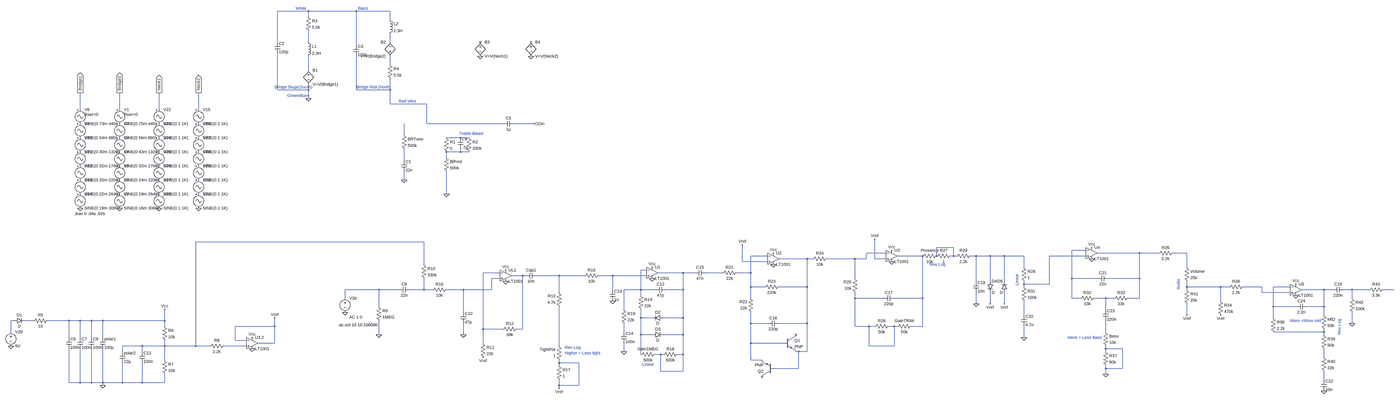
[diagram p0: schematic SST1Circuit.asc, whole sheet]
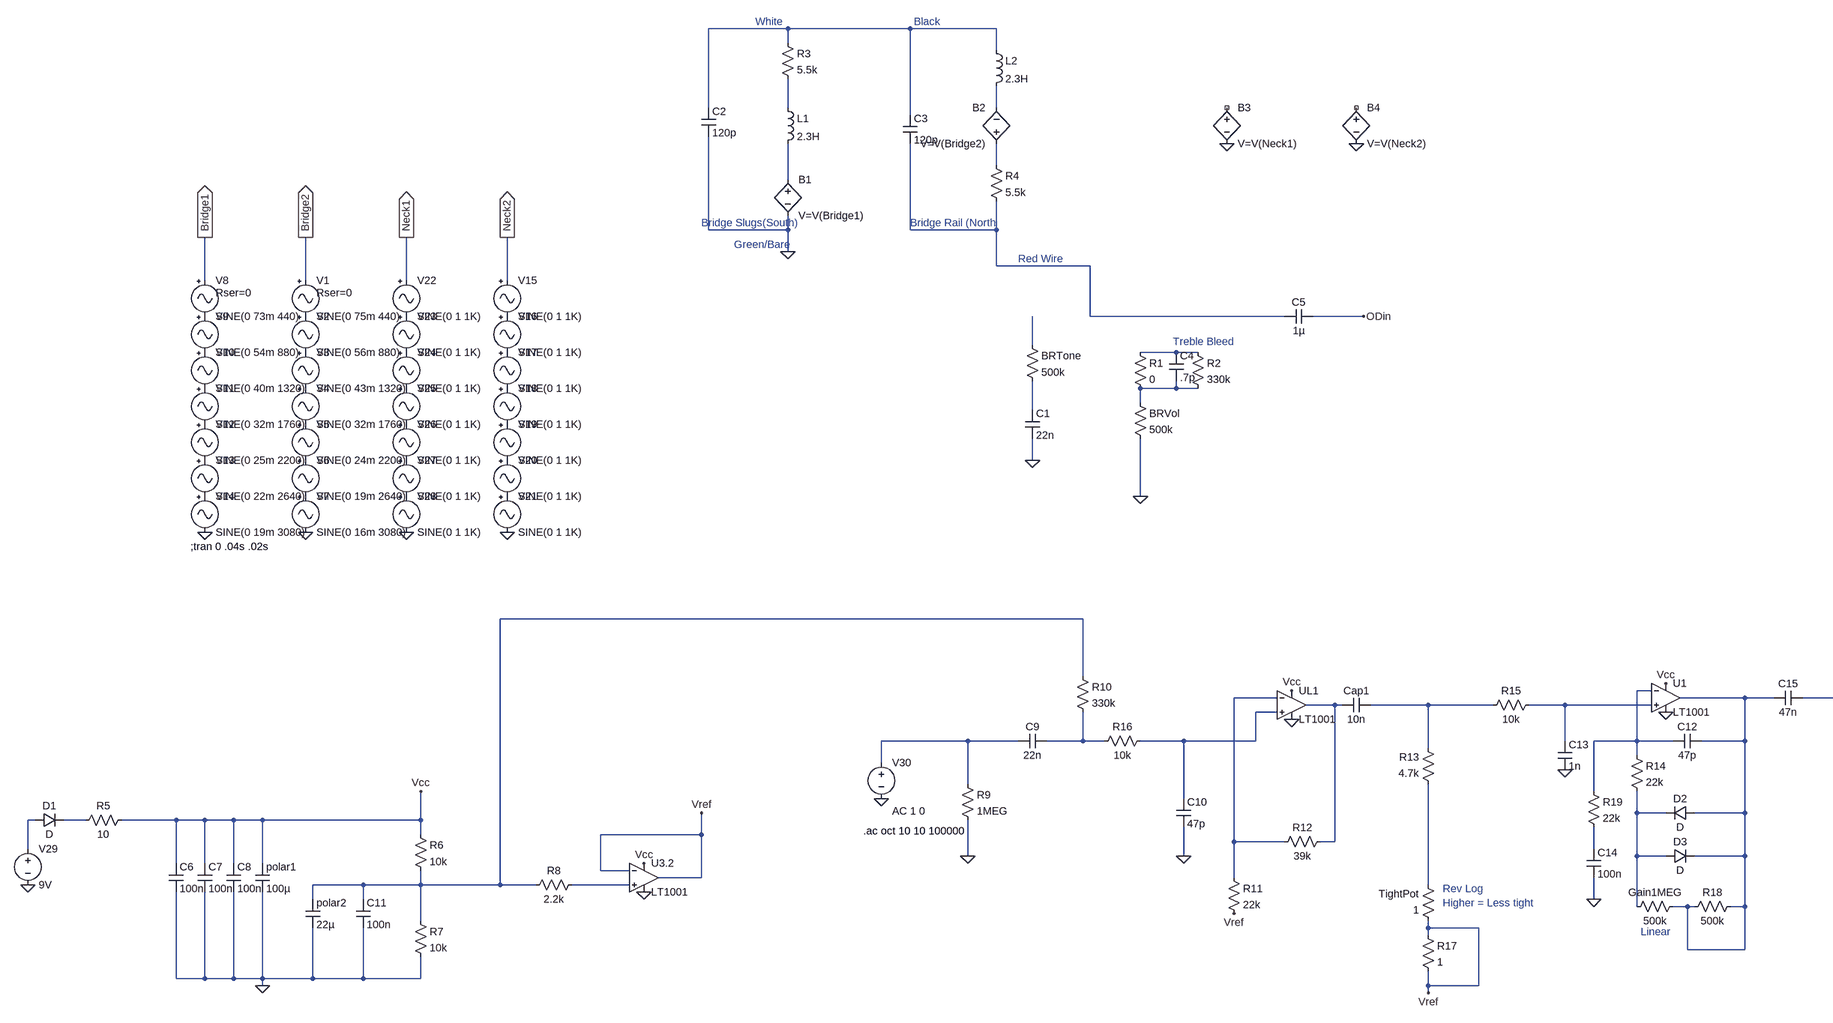
[diagram p1: schematic SST1Circuit.asc, part, row 1 of 1, column 1 of 2]
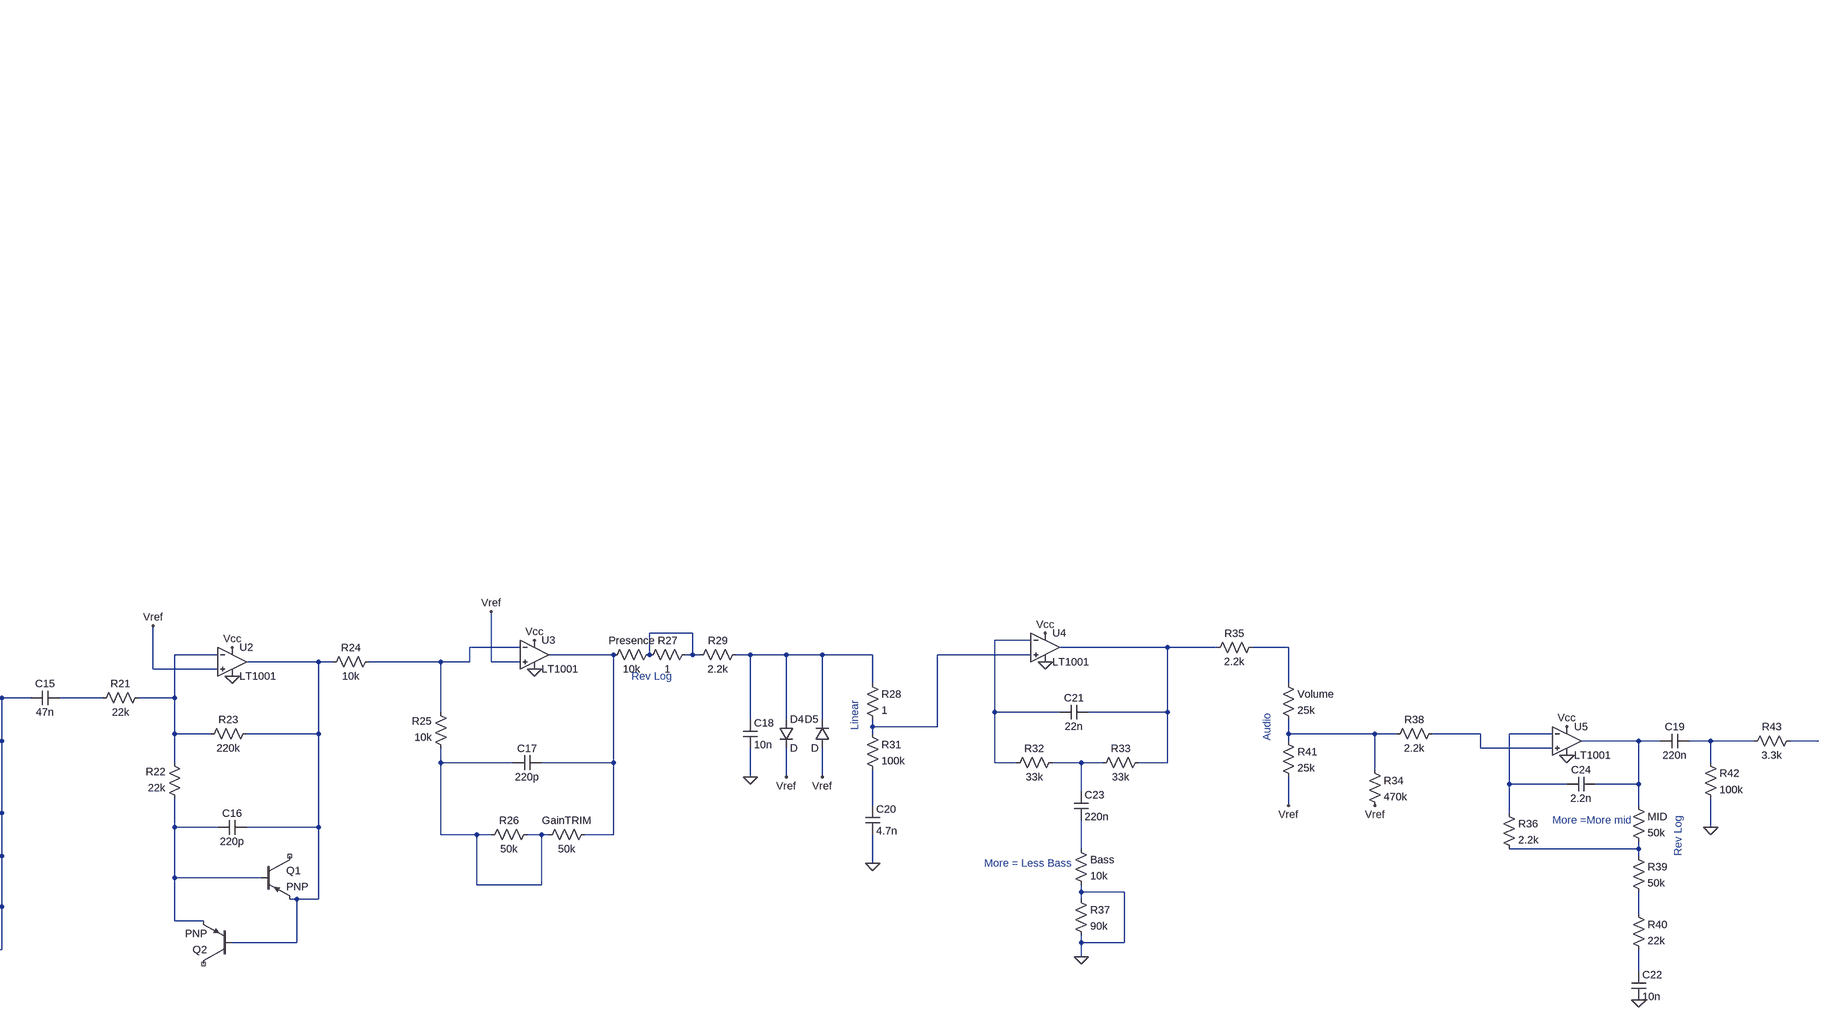
[diagram p2: schematic SST1Circuit.asc, part, row 1 of 1, column 2 of 2]
SST1Circuit.asc, the LTspice schematic file:
Version 4
SHEET 1 7556 1668
WIRE 944 -848 768 -848
WIRE 1216 -848 944 -848
WIRE 1408 -848 1216 -848
WIRE 944 -816 944 -848
WIRE 1408 -800 1408 -848
WIRE 768 -672 768 -848
WIRE 944 -672 944 -736
WIRE 1408 -672 1408 -720
WIRE 1216 -656 1216 -848
WIRE 1408 -544 1408 -592
WIRE 944 -512 944 -592
WIRE 768 -400 768 -608
WIRE 944 -400 944 -432
WIRE 944 -400 768 -400
WIRE 1216 -400 1216 -592
WIRE 1408 -400 1408 -464
WIRE 1408 -400 1216 -400
WIRE 944 -352 944 -400
WIRE 1408 -320 1408 -400
WIRE 1616 -320 1408 -320
WIRE -352 -288 -352 -384
WIRE -128 -288 -128 -384
WIRE 96 -288 96 -384
WIRE 320 -288 320 -384
WIRE 1616 -208 1616 -320
WIRE 2048 -208 1616 -208
WIRE 2224 -208 2112 -208
WIRE 1488 -144 1488 -208
WIRE 1808 -128 1728 -128
WIRE 1856 -128 1808 -128
WIRE 1808 -48 1808 -64
WIRE 1808 -48 1728 -48
WIRE 1856 -48 1808 -48
WIRE 1728 -16 1728 -48
WIRE 1488 0 1488 -64
WIRE 1488 112 1488 64
WIRE 1728 192 1728 64
WIRE 1600 656 304 656
WIRE 4608 688 4512 688
WIRE 5408 704 5328 704
WIRE 4224 720 4112 720
WIRE 5712 720 5472 720
WIRE 5856 720 5712 720
WIRE 6016 720 5936 720
WIRE 3552 736 3456 736
WIRE 4432 736 4288 736
WIRE 4512 736 4512 688
WIRE 4608 736 4608 688
WIRE 4608 736 4592 736
WIRE 4624 736 4608 736
WIRE 4736 736 4704 736
WIRE 4816 736 4736 736
WIRE 4896 736 4816 736
WIRE 5008 736 4896 736
WIRE 5408 736 5152 736
WIRE 3776 752 3616 752
WIRE 3808 752 3776 752
WIRE 4048 752 3888 752
WIRE 4112 752 4112 720
WIRE 4112 752 4048 752
WIRE 4160 752 4160 640
WIRE 4224 752 4160 752
WIRE 3408 768 3408 672
WIRE 3552 768 3408 768
WIRE 1600 784 1600 656
WIRE 5008 800 5008 736
WIRE 6016 800 6016 720
WIRE 2864 816 2832 816
WIRE 2032 832 1936 832
WIRE 3072 832 2928 832
WIRE 3136 832 3072 832
WIRE 3296 832 3200 832
WIRE 3456 832 3456 736
WIRE 3456 832 3376 832
WIRE 2160 848 2096 848
WIRE 2176 848 2160 848
WIRE 2368 848 2240 848
WIRE 2512 848 2368 848
WIRE 2672 848 2592 848
WIRE 2864 848 2672 848
WIRE 2032 864 1984 864
WIRE 4048 864 4048 752
WIRE 5328 864 5328 704
WIRE 5472 864 5328 864
WIRE 5712 864 5712 720
WIRE 5712 864 5536 864
WIRE 4736 880 4736 736
WIRE 4816 880 4816 736
WIRE 4896 880 4896 736
WIRE 5008 896 5008 880
WIRE 5152 896 5152 736
WIRE 5152 896 5008 896
WIRE 3456 912 3456 832
WIRE 3536 912 3456 912
WIRE 3776 912 3776 752
WIRE 3776 912 3616 912
WIRE 5008 912 5008 896
WIRE 6016 912 6016 880
WIRE 6208 912 6016 912
WIRE 6256 912 6208 912
WIRE 6496 912 6336 912
WIRE 6656 912 6560 912
WIRE 1344 928 1152 928
WIRE 1456 928 1344 928
WIRE 1600 928 1600 864
WIRE 1600 928 1520 928
WIRE 1648 928 1600 928
WIRE 1824 928 1728 928
WIRE 1984 928 1984 864
WIRE 1984 928 1824 928
WIRE 2672 928 2672 848
WIRE 2832 928 2832 816
WIRE 2832 928 2736 928
WIRE 2912 928 2832 928
WIRE 3072 928 3072 832
WIRE 3072 928 2976 928
WIRE 6016 928 6016 912
WIRE 6848 928 6720 928
WIRE 6896 928 6848 928
WIRE 7008 928 6960 928
WIRE 7104 928 7008 928
WIRE 7248 928 7184 928
WIRE 2368 944 2368 848
WIRE 6496 944 6496 912
WIRE 6656 944 6496 944
WIRE 2832 960 2832 928
WIRE 1152 976 1152 928
WIRE 3456 976 3456 912
WIRE 4048 976 4048 944
WIRE 4208 976 4048 976
WIRE 4432 976 4432 736
WIRE 4432 976 4272 976
WIRE 5328 976 5328 864
WIRE 5376 976 5328 976
WIRE 5520 976 5456 976
WIRE 5568 976 5520 976
WIRE 5712 976 5712 864
WIRE 5712 976 5648 976
WIRE 7008 976 7008 928
WIRE 6208 992 6208 912
WIRE 4736 1008 4736 944
WIRE 4816 1008 4816 944
WIRE 4896 1008 4896 944
WIRE 1344 1024 1344 928
WIRE 6560 1024 6560 912
WIRE 6688 1024 6560 1024
WIRE 6848 1024 6848 928
WIRE 6848 1024 6752 1024
WIRE 2736 1040 2736 928
WIRE 5520 1040 5520 976
WIRE 1824 1056 1824 928
WIRE 5008 1072 5008 992
WIRE 6016 1072 6016 1008
WIRE 6848 1072 6848 1024
WIRE 2832 1088 2832 1040
WIRE 2896 1088 2832 1088
WIRE 3072 1088 3072 928
WIRE 3072 1088 2960 1088
WIRE 6560 1088 6560 1024
WIRE -768 1104 -784 1104
WIRE -656 1104 -704 1104
WIRE -416 1104 -576 1104
WIRE -352 1104 -416 1104
WIRE -288 1104 -352 1104
WIRE -224 1104 -288 1104
WIRE 128 1104 128 1040
WIRE 128 1104 -224 1104
WIRE 3456 1120 3456 1056
WIRE 3552 1120 3456 1120
WIRE 3776 1120 3776 912
WIRE 3776 1120 3616 1120
WIRE 7008 1120 7008 1056
WIRE 128 1136 128 1104
WIRE 752 1136 752 1088
WIRE 752 1136 528 1136
WIRE 4048 1136 4048 976
WIRE 4128 1136 4048 1136
WIRE 4160 1136 4128 1136
WIRE 4272 1136 4240 1136
WIRE 4288 1136 4272 1136
WIRE 4432 1136 4432 976
WIRE 4432 1136 4368 1136
WIRE 1936 1152 1936 832
WIRE 2048 1152 1936 1152
WIRE 2160 1152 2160 848
WIRE 2160 1152 2128 1152
WIRE -784 1168 -784 1104
WIRE 2736 1168 2736 1120
WIRE 5520 1168 5520 1104
WIRE 6848 1168 6848 1152
WIRE 6848 1168 6560 1168
WIRE 1344 1184 1344 1104
WIRE 1824 1184 1824 1120
WIRE 2832 1184 2832 1088
WIRE 2896 1184 2832 1184
WIRE 3072 1184 3072 1088
WIRE 3072 1184 2960 1184
WIRE 6848 1184 6848 1168
WIRE -416 1200 -416 1104
WIRE -352 1200 -352 1104
WIRE -288 1200 -288 1104
WIRE -224 1200 -224 1104
WIRE 5008 1200 5008 1136
WIRE 528 1216 528 1136
WIRE 592 1216 528 1216
WIRE 752 1232 752 1136
WIRE 752 1232 656 1232
WIRE 1936 1232 1936 1152
WIRE 3456 1232 3456 1120
WIRE 3648 1232 3456 1232
WIRE 0 1248 -112 1248
WIRE 128 1248 128 1216
WIRE 128 1248 0 1248
WIRE 304 1248 304 656
WIRE 304 1248 128 1248
WIRE 384 1248 304 1248
WIRE 592 1248 464 1248
WIRE 2368 1248 2368 1024
WIRE 4128 1248 4128 1136
WIRE 4272 1248 4272 1136
WIRE 4272 1248 4128 1248
WIRE 5520 1264 5520 1248
WIRE 5616 1264 5520 1264
WIRE -112 1280 -112 1248
WIRE 0 1280 0 1248
WIRE 2736 1280 2736 1232
WIRE 3728 1280 3712 1280
WIRE 3776 1280 3776 1120
WIRE 3776 1280 3728 1280
WIRE 5520 1280 5520 1264
WIRE 2832 1296 2832 1184
WIRE 2944 1296 2912 1296
WIRE 2960 1296 2944 1296
WIRE 3072 1296 3072 1184
WIRE 3072 1296 3040 1296
WIRE 6848 1312 6848 1264
WIRE 128 1328 128 1248
WIRE 3456 1328 3456 1232
WIRE 3520 1328 3456 1328
WIRE 2368 1344 2368 1328
WIRE 2480 1344 2368 1344
WIRE 2368 1360 2368 1344
WIRE 3728 1376 3728 1280
WIRE 3728 1376 3584 1376
WIRE 5520 1376 5520 1360
WIRE 5616 1376 5616 1264
WIRE 5616 1376 5520 1376
WIRE 2944 1392 2944 1296
WIRE 3072 1392 3072 1296
WIRE 3072 1392 2944 1392
WIRE 5520 1408 5520 1376
WIRE 6848 1440 6848 1392
WIRE -416 1456 -416 1264
WIRE -352 1456 -352 1264
WIRE -352 1456 -416 1456
WIRE -288 1456 -288 1264
WIRE -288 1456 -352 1456
WIRE -224 1456 -224 1264
WIRE -224 1456 -288 1456
WIRE -112 1456 -112 1344
WIRE -112 1456 -224 1456
WIRE 0 1456 0 1344
WIRE 0 1456 -112 1456
WIRE 128 1456 128 1408
WIRE 128 1456 0 1456
WIRE -224 1472 -224 1456
WIRE 2368 1472 2368 1440
WIRE 2480 1472 2480 1344
WIRE 2480 1472 2368 1472
WIRE 2368 1488 2368 1472
FLAG -352 272 0
FLAG -128 272 0
FLAG 96 272 0
FLAG 320 272 0
FLAG -352 -384 Bridge1
IOPIN -352 -384 Out
FLAG -128 -384 Bridge2
IOPIN -128 -384 Out
FLAG 96 -384 Neck1
IOPIN 96 -384 Out
FLAG 320 -384 Neck2
IOPIN 320 -384 Out
FLAG 1920 -592 0
FLAG 2208 -592 0
FLAG 944 -352 0
FLAG 1488 112 0
FLAG 1728 192 0
FLAG 2224 -208 ODin
FLAG -784 1248 0
FLAG 624 1264 0
FLAG -224 1472 0
FLAG 752 1088 Vref
FLAG 128 1040 Vcc
FLAG 624 1200 Vcc
FLAG 1936 1312 Vref
FLAG 1824 1184 0
FLAG 1344 1184 0
FLAG 2064 880 0
FLAG 2064 816 Vcc
FLAG 2672 992 0
FLAG 2896 864 0
FLAG 2896 800 Vcc
FLAG 2368 1488 Vref
FLAG 3584 784 0
FLAG 3584 720 Vcc
FLAG 3408 672 Vref
FLAG 4160 640 Vref
FLAG 4256 768 0
FLAG 4256 704 Vcc
FLAG 5008 1200 0
FLAG 5440 688 Vcc
FLAG 5440 752 0
FLAG 1152 1056 0
FLAG 6688 896 Vcc
FLAG 6688 960 0
FLAG 6848 1504 0
FLAG 5520 1408 0
FLAG 2736 1280 0
FLAG 4736 1008 0
FLAG 4816 1008 Vref
FLAG 4896 1008 Vref
FLAG 6016 1072 Vref
FLAG 6208 1072 Vref
FLAG 7008 1120 0
SYMBOL Misc\\signal -128 -304 R0
WINDOW 123 0 0 Left 2
WINDOW 39 24 44 Left 2
SYMATTR SpiceLine Rser=0
SYMATTR InstName V1
SYMATTR Value SINE(0 75m 440)
SYMBOL Misc\\signal -128 -224 R0
WINDOW 123 0 0 Left 2
WINDOW 39 0 0 Left 2
SYMATTR InstName V2
SYMATTR Value SINE(0 56m 880)
SYMBOL Misc\\signal -128 -144 R0
WINDOW 123 0 0 Left 2
WINDOW 39 0 0 Left 2
SYMATTR InstName V3
SYMATTR Value SINE(0 43m 1320)
SYMBOL Misc\\signal -128 -64 R0
WINDOW 123 0 0 Left 2
WINDOW 39 0 0 Left 2
SYMATTR InstName V4
SYMATTR Value SINE(0 32m 1760)
SYMBOL Misc\\signal -128 16 R0
WINDOW 123 0 0 Left 2
WINDOW 39 0 0 Left 2
SYMATTR InstName V5
SYMATTR Value SINE(0 24m 2200)
SYMBOL Misc\\signal -128 96 R0
WINDOW 123 0 0 Left 2
WINDOW 39 0 0 Left 2
SYMATTR InstName V6
SYMATTR Value SINE(0 19m 2640)
SYMBOL Misc\\signal -128 176 R0
WINDOW 123 0 0 Left 2
WINDOW 39 0 0 Left 2
SYMATTR InstName V7
SYMATTR Value SINE(0 16m 3080)
SYMBOL Misc\\signal -352 -304 R0
WINDOW 123 0 0 Left 2
WINDOW 39 24 44 Left 2
SYMATTR SpiceLine Rser=0
SYMATTR InstName V8
SYMATTR Value SINE(0 73m 440)
SYMBOL Misc\\signal -352 -224 R0
WINDOW 123 0 0 Left 2
WINDOW 39 0 0 Left 2
SYMATTR InstName V9
SYMATTR Value SINE(0 54m 880)
SYMBOL Misc\\signal -352 -144 R0
WINDOW 123 0 0 Left 2
WINDOW 39 0 0 Left 2
SYMATTR InstName V10
SYMATTR Value SINE(0 40m 1320)
SYMBOL Misc\\signal -352 -64 R0
WINDOW 123 0 0 Left 2
WINDOW 39 0 0 Left 2
SYMATTR InstName V11
SYMATTR Value SINE(0 32m 1760)
SYMBOL Misc\\signal -352 16 R0
WINDOW 123 0 0 Left 2
WINDOW 39 0 0 Left 2
SYMATTR InstName V12
SYMATTR Value SINE(0 25m 2200)
SYMBOL Misc\\signal -352 96 R0
WINDOW 123 0 0 Left 2
WINDOW 39 0 0 Left 2
SYMATTR InstName V13
SYMATTR Value SINE(0 22m 2640)
SYMBOL Misc\\signal -352 176 R0
WINDOW 123 0 0 Left 2
WINDOW 39 0 0 Left 2
SYMATTR InstName V14
SYMATTR Value SINE(0 19m 3080)
SYMBOL Misc\\signal 320 -304 R0
SYMATTR InstName V15
SYMBOL Misc\\signal 320 -224 R0
SYMATTR InstName V16
SYMBOL Misc\\signal 320 -144 R0
SYMATTR InstName V17
SYMBOL Misc\\signal 320 -64 R0
SYMATTR InstName V18
SYMBOL Misc\\signal 320 16 R0
SYMATTR InstName V19
SYMBOL Misc\\signal 320 96 R0
SYMATTR InstName V20
SYMBOL Misc\\signal 320 176 R0
SYMATTR InstName V21
SYMBOL Misc\\signal 96 -304 R0
SYMATTR InstName V22
SYMBOL Misc\\signal 96 -224 R0
SYMATTR InstName V23
SYMBOL Misc\\signal 96 -144 R0
SYMATTR InstName V24
SYMBOL Misc\\signal 96 -64 R0
SYMATTR InstName V25
SYMBOL Misc\\signal 96 16 R0
SYMATTR InstName V26
SYMBOL Misc\\signal 96 96 R0
SYMATTR InstName V27
SYMBOL Misc\\signal 96 176 R0
SYMATTR InstName V28
SYMBOL bv 944 -528 R0
SYMATTR InstName B1
SYMATTR Value V=V(Bridge1)
SYMBOL bv 1408 -576 R180
WINDOW 0 24 96 Left 2
WINDOW 3 24 16 Left 2
SYMATTR InstName B2
SYMATTR Value V=V(Bridge2)
SYMBOL bv 1920 -688 R0
SYMATTR InstName B3
SYMATTR Value V=V(Neck1)
SYMBOL bv 2208 -688 R0
SYMATTR InstName B4
SYMATTR Value V=V(Neck2)
SYMBOL res 1472 -160 R0
SYMATTR InstName BRTone
SYMATTR Value 500k
SYMBOL res 1712 -32 R0
SYMATTR InstName BRVol
SYMATTR Value 500k
SYMBOL cap 1472 0 R0
SYMATTR InstName C1
SYMATTR Value 22n
SYMATTR SpiceLine V=25 Irms=25 Rser=0
SYMBOL res 928 -832 R0
SYMATTR InstName R3
SYMATTR Value 5.5k
SYMBOL res 1392 -560 R0
SYMATTR InstName R4
SYMATTR Value 5.5k
SYMBOL cap 752 -672 R0
SYMATTR InstName C2
SYMATTR Value 120p
SYMBOL ind 928 -688 R0
SYMATTR InstName L1
SYMATTR Value 2.3H
SYMBOL ind 1392 -816 R0
SYMATTR InstName L2
SYMATTR Value 2.3H
SYMBOL cap 1200 -656 R0
SYMATTR InstName C3
SYMATTR Value 120p
SYMBOL cap 1792 -128 R0
SYMATTR InstName C4
SYMATTR Value .7p
SYMBOL res 1840 -144 R0
SYMATTR InstName R2
SYMATTR Value 330k
SYMBOL res 1712 -144 R0
SYMATTR InstName R1
SYMATTR Value 0
SYMBOL cap 2112 -224 R90
WINDOW 0 0 32 VBottom 2
WINDOW 3 32 32 VTop 2
SYMATTR InstName C5
SYMATTR Value 1µ
SYMBOL voltage -784 1152 R0
WINDOW 123 0 0 Left 2
WINDOW 39 0 0 Left 2
SYMATTR InstName V29
SYMATTR Value 9V
SYMBOL res -560 1088 R90
WINDOW 0 0 56 VBottom 2
WINDOW 3 32 56 VTop 2
SYMATTR InstName R5
SYMATTR Value 10
SYMBOL diode -768 1120 R270
WINDOW 0 32 32 VTop 2
WINDOW 3 0 32 VBottom 2
SYMATTR InstName D1
SYMBOL cap -432 1200 R0
SYMATTR InstName C6
SYMATTR Value 100n
SYMBOL cap -368 1200 R0
SYMATTR InstName C7
SYMATTR Value 100n
SYMBOL cap -304 1200 R0
SYMATTR InstName C8
SYMATTR Value 100n
SYMBOL cap -240 1200 R0
SYMATTR InstName polar1
SYMATTR Value 100µ
SYMBOL cap -128 1280 R0
SYMATTR InstName polar2
SYMATTR Value 22µ
SYMBOL cap -16 1280 R0
SYMATTR InstName C11
SYMATTR Value 100n
SYMBOL res 112 1120 R0
SYMATTR InstName R6
SYMATTR Value 10k
SYMBOL res 112 1312 R0
SYMATTR InstName R7
SYMATTR Value 10k
SYMBOL res 480 1232 R90
WINDOW 0 0 56 VBottom 2
WINDOW 3 32 56 VTop 2
SYMATTR InstName R8
SYMATTR Value 2.2k
SYMBOL Opamps\\LT1001 624 1168 R0
SYMATTR InstName U3.2
SYMBOL res 1328 1008 R0
SYMATTR InstName R9
SYMATTR Value 1MEG
SYMBOL res 1584 768 R0
SYMATTR InstName R10
SYMATTR Value 330k
SYMBOL res 1920 1216 R0
SYMATTR InstName R11
SYMATTR Value 22k
SYMBOL res 2144 1136 R90
WINDOW 0 0 56 VBottom 2
WINDOW 3 32 56 VTop 2
SYMATTR InstName R12
SYMATTR Value 39k
SYMBOL res 2384 1040 R180
WINDOW 0 36 76 Left 2
WINDOW 3 36 40 Left 2
SYMATTR InstName R13
SYMATTR Value 4.7k
SYMBOL res 2384 1344 R180
WINDOW 0 36 76 Left 2
WINDOW 3 36 40 Left 2
SYMATTR InstName TightPot
SYMATTR Value 1
SYMBOL res 2496 864 R270
WINDOW 0 32 56 VTop 2
WINDOW 3 0 56 VBottom 2
SYMATTR InstName R15
SYMATTR Value 10k
SYMBOL cap 1520 912 R90
WINDOW 0 0 32 VBottom 2
WINDOW 3 32 32 VTop 2
SYMATTR InstName C9
SYMATTR Value 22n
SYMBOL res 1744 912 R90
WINDOW 0 0 56 VBottom 2
WINDOW 3 32 56 VTop 2
SYMATTR InstName R16
SYMATTR Value 10k
SYMBOL cap 1808 1056 R0
SYMATTR InstName C10
SYMATTR Value 47p
SYMBOL cap 2240 832 R90
WINDOW 0 0 32 VBottom 2
WINDOW 3 32 32 VTop 2
SYMATTR InstName Cap1
SYMATTR Value 10n
SYMBOL Opamps\\LT1001 2064 784 R0
SYMATTR InstName UL1
SYMBOL res 2352 1344 R0
SYMATTR InstName R17
SYMATTR Value 1
SYMBOL cap 2656 928 R0
SYMATTR InstName C13
SYMATTR Value 1n
SYMBOL Opamps\\LT1001 2896 768 R0
SYMATTR InstName U1
SYMBOL diode 2960 1072 R90
WINDOW 0 0 32 VBottom 2
WINDOW 3 32 32 VTop 2
SYMATTR InstName D2
SYMBOL diode 2896 1200 R270
WINDOW 0 32 32 VTop 2
WINDOW 3 0 32 VBottom 2
SYMATTR InstName D3
SYMBOL res 2928 1280 R90
WINDOW 0 0 56 VBottom 2
WINDOW 3 32 56 VTop 2
SYMATTR InstName Gain1MEG
SYMATTR Value 500k
SYMBOL res 3056 1280 R90
WINDOW 0 0 56 VBottom 2
WINDOW 3 32 56 VTop 2
SYMATTR InstName R18
SYMATTR Value 500k
SYMBOL cap 3200 816 R90
WINDOW 0 0 32 VBottom 2
WINDOW 3 32 32 VTop 2
SYMATTR InstName C15
SYMATTR Value 47n
SYMBOL res 3392 816 R90
WINDOW 0 0 56 VBottom 2
WINDOW 3 32 56 VTop 2
SYMATTR InstName R21
SYMATTR Value 22k
SYMBOL res 3472 1072 R180
WINDOW 0 36 76 Left 2
WINDOW 3 36 40 Left 2
SYMATTR InstName R22
SYMATTR Value 22k
SYMBOL res 3520 928 R270
WINDOW 0 32 56 VTop 2
WINDOW 3 0 56 VBottom 2
SYMATTR InstName R23
SYMATTR Value 220k
SYMBOL cap 3616 1104 R90
WINDOW 0 0 32 VBottom 2
WINDOW 3 32 32 VTop 2
SYMATTR InstName C16
SYMATTR Value 220p
SYMBOL Opamps\\LT1001 3584 688 R0
SYMATTR InstName U2
SYMBOL res 3904 736 R90
WINDOW 0 0 56 VBottom 2
WINDOW 3 32 56 VTop 2
SYMATTR InstName R24
SYMATTR Value 10k
SYMBOL res 4064 960 R180
WINDOW 0 36 76 Left 2
WINDOW 3 36 40 Left 2
SYMATTR InstName R25
SYMATTR Value 10k
SYMBOL res 4144 1152 R270
WINDOW 0 32 56 VTop 2
WINDOW 3 0 56 VBottom 2
SYMATTR InstName R26
SYMATTR Value 50k
SYMBOL res 4272 1152 R270
WINDOW 0 32 56 VTop 2
WINDOW 3 0 56 VBottom 2
SYMATTR InstName GainTRIM
SYMATTR Value 50k
SYMBOL cap 4272 960 R90
WINDOW 0 0 32 VBottom 2
WINDOW 3 32 32 VTop 2
SYMATTR InstName C17
SYMATTR Value 220p
SYMBOL Opamps\\LT1001 4256 672 R0
SYMATTR InstName U3
SYMBOL res 4992 784 R0
SYMATTR InstName R28
SYMATTR Value 1
SYMBOL res 4992 896 R0
SYMATTR InstName R31
SYMATTR Value 100k
SYMBOL cap 4992 1072 R0
SYMATTR InstName C20
SYMATTR Value 4.7n
SYMBOL Opamps\\LT1001 5440 656 R0
SYMATTR InstName U4
SYMBOL res 5472 960 R90
WINDOW 0 0 56 VBottom 2
WINDOW 3 32 56 VTop 2
SYMATTR InstName R32
SYMATTR Value 33k
SYMBOL res 5664 960 R90
WINDOW 0 0 56 VBottom 2
WINDOW 3 32 56 VTop 2
SYMATTR InstName R33
SYMATTR Value 33k
SYMBOL cap 5536 848 R90
WINDOW 0 0 32 VBottom 2
WINDOW 3 32 32 VTop 2
SYMATTR InstName C21
SYMATTR Value 22n
SYMBOL cap 5504 1040 R0
SYMATTR InstName C23
SYMATTR Value 220n
SYMBOL res 5504 1152 R0
SYMATTR InstName Bass
SYMATTR Value 10k
SYMBOL res 5504 1264 R0
SYMATTR InstName R37
SYMATTR Value 90k
SYMBOL voltage 1152 960 R0
WINDOW 123 24 124 Left 2
WINDOW 39 0 0 Left 2
SYMATTR Value2 AC 1 0
SYMATTR InstName V30
SYMATTR Value ""
SYMBOL Opamps\\LT1001 6688 864 R0
SYMATTR InstName U5
SYMBOL res 5952 704 R90
WINDOW 0 0 56 VBottom 2
WINDOW 3 32 56 VTop 2
SYMATTR InstName R35
SYMATTR Value 2.2k
SYMBOL res 6544 1072 R0
SYMATTR InstName R36
SYMATTR Value 2.2k
SYMBOL res 6832 1056 R0
SYMATTR InstName MID
SYMATTR Value 50k
SYMBOL res 6832 1168 R0
SYMATTR InstName R39
SYMATTR Value 50k
SYMBOL res 6832 1296 R0
SYMATTR InstName R40
SYMATTR Value 22k
SYMBOL cap 6832 1440 R0
SYMATTR InstName C22
SYMATTR Value 10n
SYMBOL res 6000 784 R0
SYMATTR InstName Volume
SYMATTR Value 25k
SYMBOL res 6000 912 R0
SYMATTR InstName R41
SYMATTR Value 25k
SYMBOL cap 6752 1008 R90
WINDOW 0 0 32 VBottom 2
WINDOW 3 32 32 VTop 2
SYMATTR InstName C24
SYMATTR Value 2.2n
SYMBOL cap 2976 912 R90
WINDOW 0 0 32 VBottom 2
WINDOW 3 32 32 VTop 2
SYMATTR InstName C12
SYMATTR Value 47p
SYMBOL res 2816 944 R0
SYMATTR InstName R14
SYMATTR Value 22k
SYMBOL res 2720 1024 R0
SYMATTR InstName R19
SYMATTR Value 22k
SYMBOL cap 2720 1168 R0
SYMATTR InstName C14
SYMATTR Value 100n
SYMBOL pnp 3648 1184 R0
SYMATTR InstName Q1
SYMBOL pnp 3584 1424 R180
SYMATTR InstName Q2
SYMBOL res 4528 720 R90
WINDOW 0 0 56 VBottom 2
WINDOW 3 32 56 VTop 2
SYMATTR InstName Presence
SYMATTR Value 10k
SYMBOL res 4608 720 R90
WINDOW 0 0 56 VBottom 2
WINDOW 3 32 56 VTop 2
SYMATTR InstName R27
SYMATTR Value 1
SYMBOL res 4720 720 R90
WINDOW 0 0 56 VBottom 2
WINDOW 3 32 56 VTop 2
SYMATTR InstName R29
SYMATTR Value 2.2k
SYMBOL cap 4720 880 R0
SYMATTR InstName C18
SYMATTR Value 10n
SYMBOL diode 4800 880 R0
SYMATTR InstName D4
SYMBOL diode 4912 944 R180
WINDOW 0 24 64 Left 2
WINDOW 3 24 0 Left 2
SYMATTR InstName D5
SYMBOL cap 6960 912 R90
WINDOW 0 0 32 VBottom 2
WINDOW 3 32 32 VTop 2
SYMATTR InstName C19
SYMATTR Value 220n
SYMBOL res 6192 976 R0
SYMATTR InstName R34
SYMATTR Value 470k
SYMBOL res 6352 896 R90
WINDOW 0 0 56 VBottom 2
WINDOW 3 32 56 VTop 2
SYMATTR InstName R38
SYMATTR Value 2.2k
SYMBOL res 6992 960 R0
SYMATTR InstName R42
SYMATTR Value 100k
SYMBOL res 7200 912 R90
WINDOW 0 0 56 VBottom 2
WINDOW 3 32 56 VTop 2
SYMATTR InstName R43
SYMATTR Value 3.3k
TEXT -384 304 Left 2 !;tran 0 .04s .02s
TEXT 1800 -152 Left 2 ;Treble Bleed
TEXT 1216 -416 Left 2 ;Bridge Rail (North
TEXT 752 -416 Left 2 ;Bridge Slugs(South)
TEXT 1456 -336 Left 2 ;Red Wire
TEXT 824 -368 Left 2 ;Green/Bare
TEXT 1224 -864 Left 2 ;Black
TEXT 872 -864 Left 2 ;White
TEXT 1112 1128 Left 2 !.ac oct 10 10 100000
TEXT 2400 1288 Left 2 ;Higher = Less tight
TEXT 5304 1200 Left 2 ;More = Less Bass
TEXT 6656 1104 Left 2 ;More =More mid
TEXT 2400 1256 Left 2 ;Rev Log
TEXT 2840 1352 Left 2 ;Linear
TEXT 4472 784 Left 2 ;Rev Log
TEXT 4968 904 VLeft 2 ;Linear
TEXT 5968 928 VLeft 2 ;Audio
TEXT 6936 1184 VLeft 2 ;Rev Log

The netlist it stands for:
* SST1Circuit.asc
V1 Bridge2 P001 SINE(0 75m 440) Rser=0
V2 P001 P002 SINE(0 56m 880)
V3 P002 P003 SINE(0 43m 1320)
V4 P003 P004 SINE(0 32m 1760)
V5 P004 P005 SINE(0 24m 2200)
V6 P005 P006 SINE(0 19m 2640)
V7 P006 0 SINE(0 16m 3080)
V8 Bridge1 P007 SINE(0 73m 440) Rser=0
V9 P007 P008 SINE(0 54m 880)
V10 P008 P009 SINE(0 40m 1320)
V11 P009 P010 SINE(0 32m 1760)
V12 P010 P011 SINE(0 25m 2200)
V13 P011 P012 SINE(0 22m 2640)
V14 P012 0 SINE(0 19m 3080)
V15 Neck2 P013 SINE(0 1 1K)
V16 P013 P014 SINE(0 1 1K)
V17 P014 P015 SINE(0 1 1K)
V18 P015 P016 SINE(0 1 1K)
V19 P016 P017 SINE(0 1 1K)
V20 P017 P018 SINE(0 1 1K)
V21 P018 0 SINE(0 1 1K)
V22 Neck1 P019 SINE(0 1 1K)
V23 P019 P020 SINE(0 1 1K)
V24 P020 P021 SINE(0 1 1K)
V25 P021 P022 SINE(0 1 1K)
V26 P022 P023 SINE(0 1 1K)
V27 P023 P024 SINE(0 1 1K)
V28 P024 0 SINE(0 1 1K)
B1 N005 0 V=V(Bridge1)
B2 N004 N003 V=V(Bridge2)
B3 NC_01 0 V=V(Neck1)
B4 NC_02 0 V=V(Neck2)
R§BRTone N007 N010 500k
R§BRVol N009 0 500k
C1 N010 0 22n V=25 Irms=25 Rser=0
R3 N001 N002 5.5k
R4 N004 N006 5.5k
C2 N001 0 120p
L1 N002 N005 2.3H
L2 N001 N003 2.3H
C3 N001 N006 120p
C4 N008 N009 .7p
R2 N008 N009 330k
R1 N008 N009 0
C5 ODin N006 1µ
V29 N042 0 9V
R5 Vcc N043 10
D1 N042 N043 D
C6 Vcc 0 100n
C7 Vcc 0 100n
C8 Vcc 0 100n
C§polar1 Vcc 0 100µ
C§polar2 N011 0 22µ
C11 N011 0 100n
R6 Vcc N011 10k
R7 N011 0 10k
R8 N048 N011 2.2k
XU3.2 N048 Vref Vcc 0 Vref LT1001  ; pins In+ In- V+ V- OUT
R9 N033 0 1MEG
R10 N011 N034 330k
R11 N023 Vref 22k
R12 N026 N023 39k
R13 N049 N027 4.7k
R§TightPot Vref N049 1
R15 N027 N028 10k
C9 N034 N033 22n
R16 N029 N034 10k
C10 N029 0 47p
Cap1 N027 N026 10n
XUL1 N029 N023 Vcc 0 N026 LT1001  ; pins In+ In- V+ V- OUT
R17 Vref Vref 1
C13 N028 0 1n
XU1 N028 N022 Vcc 0 N024 LT1001  ; pins In+ In- V+ V- OUT
D2 N024 N041 D
D3 N041 N024 D
R§Gain1MEG N024 N041 500k
R18 N024 N024 500k
C15 N025 N024 47n
R21 N017 N025 22k
R22 N044 N017 22k
R23 N017 N021 220k
C16 N021 N044 220p
XU2 Vref N017 Vcc 0 N021 LT1001  ; pins In+ In- V+ V- OUT
R24 N014 N021 10k
R25 N038 N014 10k
R26 N038 N038 50k
R§GainTRIM N038 N018 50k
C17 N018 N038 220p
XU3 Vref N014 Vcc 0 N018 LT1001  ; pins In+ In- V+ V- OUT
R28 N019 N020 1
R31 N020 N040 100k
C20 N040 0 4.7n
XU4 N020 N013 Vcc 0 N015 LT1001  ; pins In+ In- V+ V- OUT
R32 N039 N013 33k
R33 N015 N039 33k
C21 N015 N013 22n
C23 N039 N046 220n
R§Bass N046 0 10k
R37 0 0 90k
V30 N033 0 AC 1 0
XU5 N031 N032 Vcc 0 N035 LT1001  ; pins In+ In- V+ V- OUT
R35 N016 N015 2.2k
R36 N032 N047 2.2k
R§MID N035 N047 50k
R39 N047 N050 50k
R40 N050 N051 22k
C22 N051 0 10n
R§Volume N016 N030 25k
R41 N030 Vref 25k
C24 N035 N032 2.2n
C12 N024 N022 47p
R14 N022 N041 22k
R19 N022 N045 22k
C14 N045 0 100n
Q1 NC_03 N044 N021 0 PNP
Q2 NC_04 N021 N044 0 PNP
R§Presence N012 N018 10k
R27 N012 N012 1
R29 N019 N012 2.2k
C18 N019 0 10n
D4 N019 Vref D
D5 Vref N019 D
C19 N036 N035 220n
R34 N030 Vref 470k
R38 N031 N030 2.2k
R42 N036 0 100k
R43 N037 N036 3.3k
.model D D
.lib standard.dio
.model NPN NPN
.model PNP PNP
.lib standard.bjt
;tran 0 .04s .02s
* Treble Bleed
* Bridge Rail (North
* Bridge Slugs(South)
* Red Wire
* Green/Bare
* Black
* White
.ac oct 10 10 100000
* Higher = Less tight
* More = Less Bass
* More =More mid
* Rev Log
* Linear
* Rev Log
* Linear
* Audio
* Rev Log
.lib LTC.lib
.backanno
.end